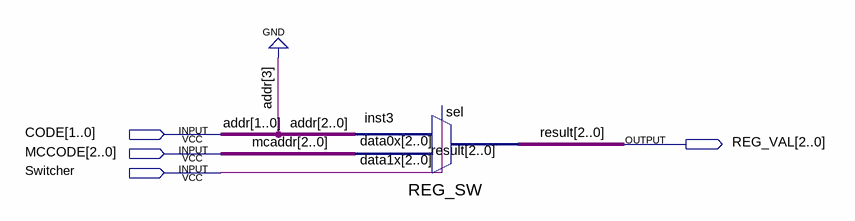
[diagram p0: schematic sheet]
// Quartus schematic REG_SRC_SWITCHER.bdf as structural Verilog: 1 symbols, 4 pins
module REG_SRC_SWITCHER (
  input  [1:0] CODE,
  input  [2:0] MCCODE,
  input  Switcher,
  output [2:0] REG_VAL
);

  wire [2:2] addr;

  REG_SW inst3 (.data1x(MCCODE), .data0x({addr[2], CODE}), .sel(Switcher), .result(REG_VAL));

  // Other names for the same wires on the sheet: addr[1:0] = CODE; mcaddr[2:0] = MCCODE; result[2:0] = REG_VAL
endmodule
